# EAGLE design v1.1 Main (EAGLE 9.7.0)
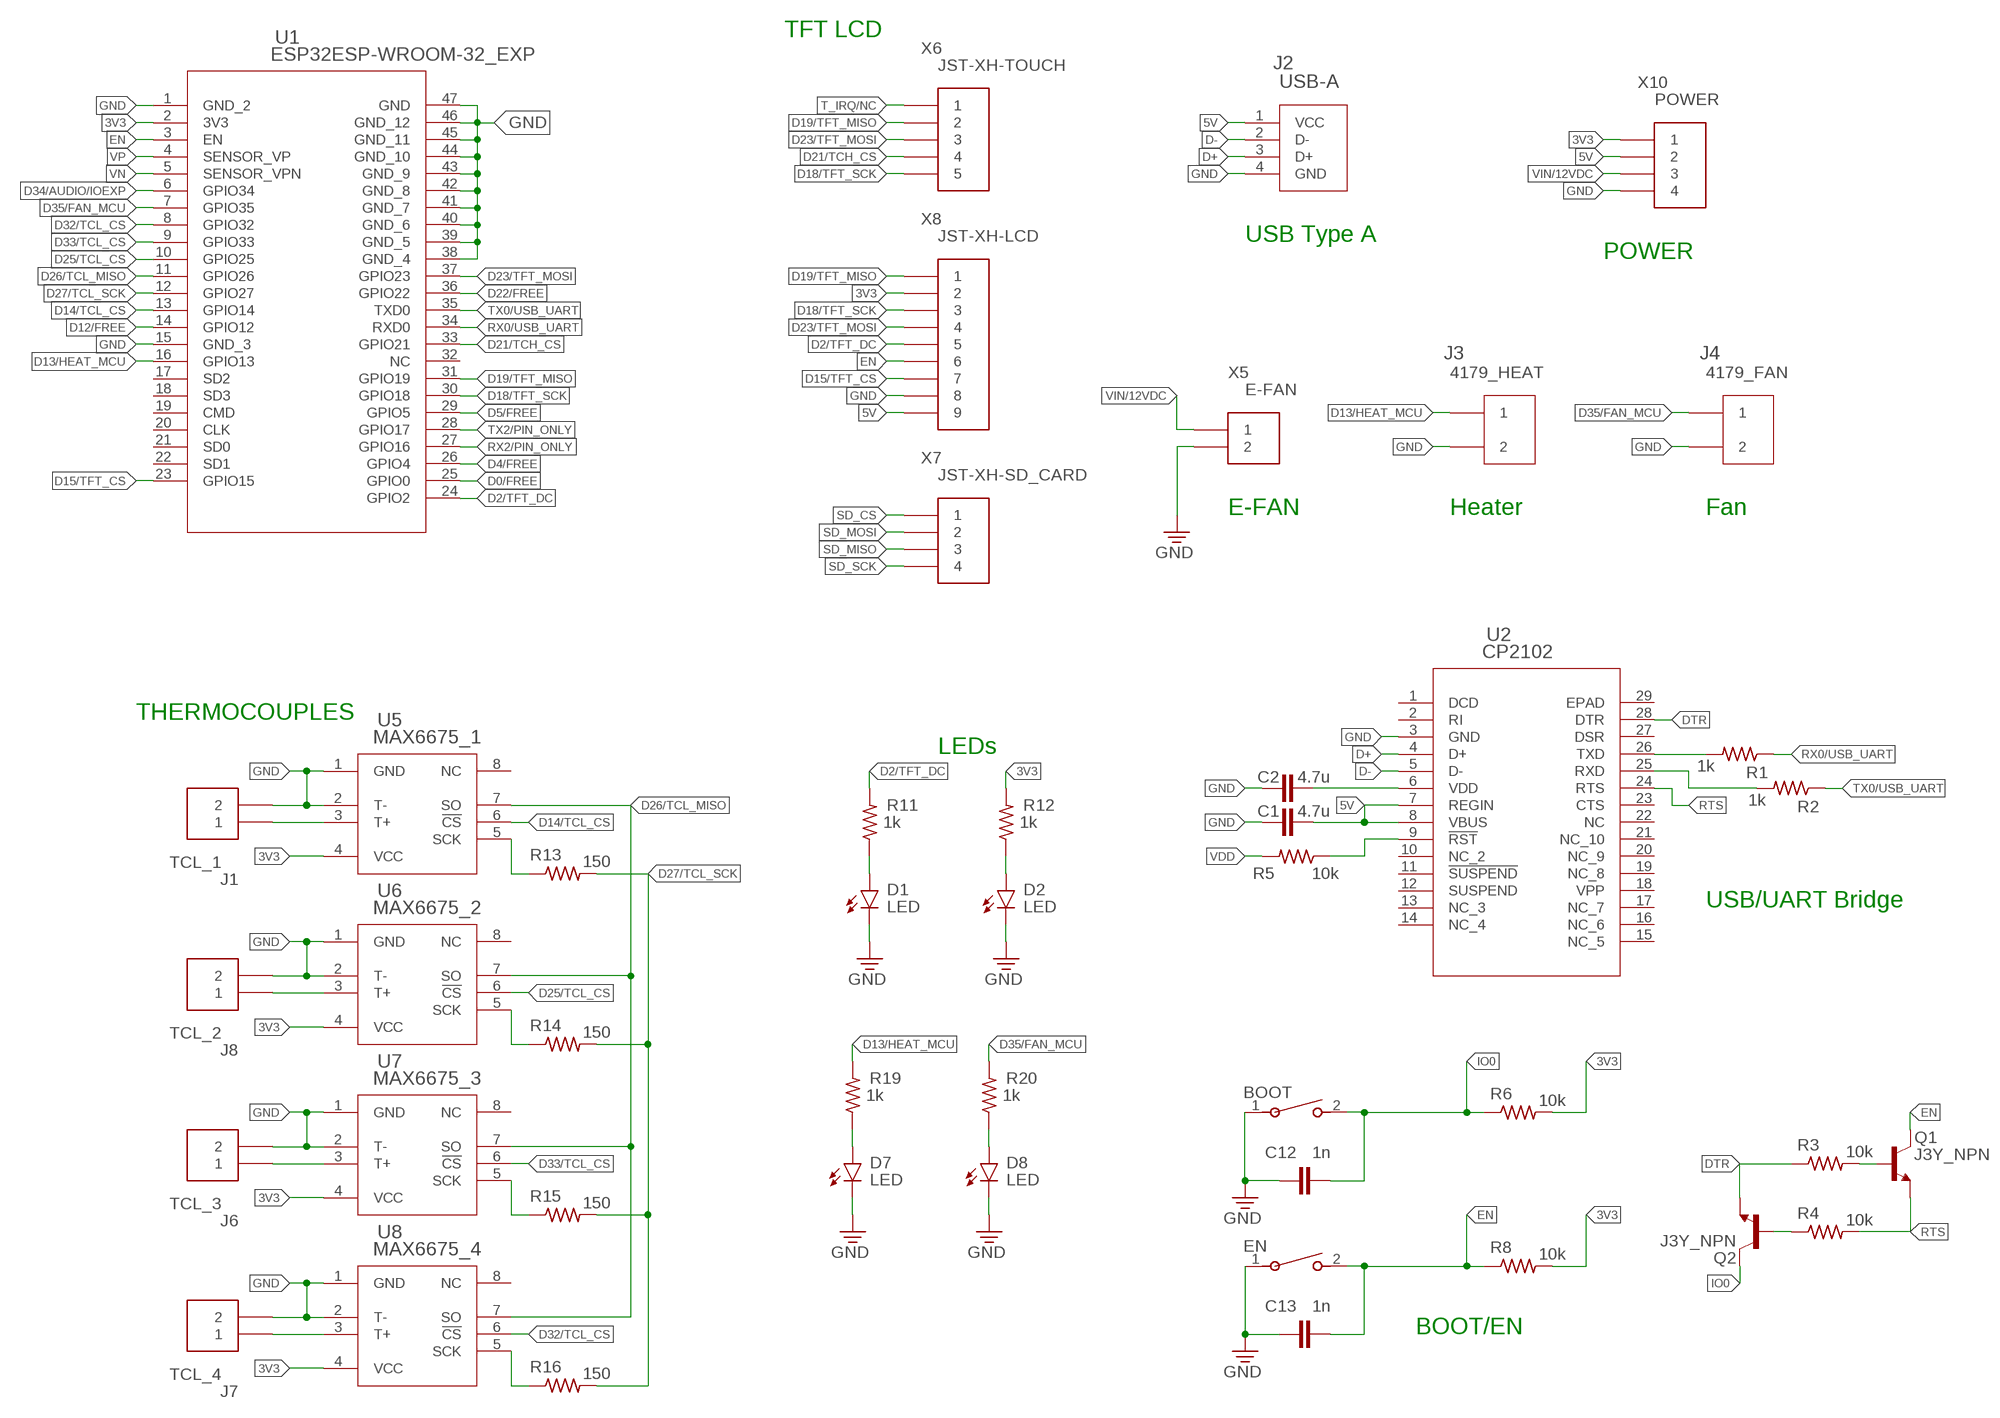
[diagram p0: schematic, sheet 1]

## Parts
BOOT  EVQ22705RSW_EVQ22705R_PAN  [SW_EVQ22705R_PAN]
C1  4.7u  C_CHIP-0805(2012-METRIC)  [CAPC2012X110]
C2  4.7u  C_CHIP-0805(2012-METRIC)  [CAPC2012X110]
C12  1n  C_CHIP-0805(2012-METRIC)  [CAPC2012X110]
C13  1n  C_CHIP-0805(2012-METRIC)  [CAPC2012X110]
D1  LED  CHIP-FLAT-B_0805  [LEDC2012X110N_FLAT-B]
D2  LED  CHIP-FLAT-B_0805  [LEDC2012X110N_FLAT-B]
D7  LED  CHIP-FLAT-B_0805  [LEDC2012X110N_FLAT-B]
D8  LED  CHIP-FLAT-B_0805  [LEDC2012X110N_FLAT-B]
EN  EVQ22705RSW_EVQ22705R_PAN  [SW_EVQ22705R_PAN]
J1  TCL_1  OSTVN02A150CONN_OSTVN02A150_OST  [CONN_OSTVN02A150_OST]
J2  USB-A  USB-A1VSB6_OST  [USB-A]
J3  4179_HEAT  4179_SDA  [41791]
J4  4179_FAN  4179_SDA  [41791]
J6  TCL_3  OSTVN02A150CONN_OSTVN02A150_OST  [CONN_OSTVN02A150_OST]
J7  TCL_4  OSTVN02A150CONN_OSTVN02A150_OST  [CONN_OSTVN02A150_OST]
J8  TCL_2  OSTVN02A150CONN_OSTVN02A150_OST  [CONN_OSTVN02A150_OST]
Q1  J3Y_NPN  NPN_SC59-BEC  [SC59]
Q2  J3Y_NPN  NPN_SC59-BEC  [SC59]
R1  1k  R-US_CHIP-0805(2012-METRIC)  [RESC2012X65]
R2  1k  R-US_CHIP-0805(2012-METRIC)  [RESC2012X65]
R3  10k  R-US_CHIP-0805(2012-METRIC)  [RESC2012X65]
R4  10k  R-US_CHIP-0805(2012-METRIC)  [RESC2012X65]
R5  10k  R-US_CHIP-0805(2012-METRIC)  [RESC2012X65]
R6  10k  R-US_CHIP-0805(2012-METRIC)  [RESC2012X65]
R8  10k  R-US_CHIP-0805(2012-METRIC)  [RESC2012X65]
R11  1k  R-US_CHIP-0805(2012-METRIC)  [RESC2012X65]
R12  1k  R-US_CHIP-0805(2012-METRIC)  [RESC2012X65]
R13  150  R-US_CHIP-0805(2012-METRIC)  [RESC2012X65]
R14  150  R-US_CHIP-0805(2012-METRIC)  [RESC2012X65]
R15  150  R-US_CHIP-0805(2012-METRIC)  [RESC2012X65]
R16  150  R-US_CHIP-0805(2012-METRIC)  [RESC2012X65]
R19  1k  R-US_CHIP-0805(2012-METRIC)  [RESC2012X65]
R20  1k  R-US_CHIP-0805(2012-METRIC)  [RESC2012X65]
U1  ESP32ESP-WROOM-32_EXP  [ESP32_SCH_PCB]
U2  CP2102  CP2102-GMQFN28_5X5_SIL  [QFN28_5X5_SIL]
U5  MAX6675_1  MAX6675_ISA_MXM  [_ISA_MXM]
U6  MAX6675_2  MAX6675_ISA_MXM  [_ISA_MXM]
U7  MAX6675_3  MAX6675_ISA_MXM  [_ISA_MXM]
U8  MAX6675_4  MAX6675_ISA_MXM  [_ISA_MXM]
X5  E-FAN  JST-XH-02-PIN-LONG-PAD  [-LONG-PAD]
X6  JST-XH-TOUCH  JST-XH-05-PIN-LONG-PAD  [JST-XH-05-PACKAGE-LONG-PAD]
X7  JST-XH-SD_CARD  JST-XH-04-PIN-LONG-PAD  [JST-XH-04-PACKAGE-LONG-PAD]
X8  JST-XH-LCD  JST-XH-09-PIN-LONG-PAD  [JST-XH-09-PACKAGE-LONG-PAD]
X10  POWER  JST-XH-04-PIN-LONG-PAD  [JST-XH-04-PACKAGE-LONG-PAD]

## Nets
3V3: R6.2 R8.2 R12.2 U1.2(3V3) U5.4(VCC) U6.4(VCC) U7.4(VCC) U8.4(VCC) X8.2 X10.1
5V: C1.2 J2.1(VCC) U2.7(REGIN) U2.8(VBUS) X8.9 X10.2
D0/FREE: U1.25(GPIO0)
D2/TFT_DC: R11.2 U1.24(GPIO2) X8.5
D4/FREE: U1.26(GPIO4)
D5/FREE: U1.29(GPIO5)
D12/FREE: U1.14(GPIO12)
D13/HEAT_MCU: J3.1 R19.2 U1.16(GPIO13)
D14/TCL_CS: U1.13(GPIO14) U5.6(!CS)
D15/TFT_CS: U1.23(GPIO15) X8.7
D18/TFT_SCK: U1.30(GPIO18) X6.5 X8.3
D19/TFT_MISO: U1.31(GPIO19) X6.2 X8.1
D21/TCH_CS: U1.33(GPIO21) X6.4
D22/FREE: U1.36(GPIO22)
D23/TFT_MOSI: U1.37(GPIO23) X6.3 X8.4
D25/TCL_CS: U1.10(GPIO25) U6.6(!CS)
D26/TCL_MISO: U1.11(GPIO26) U5.7(SO) U6.7(SO) U7.7(SO) U8.7(SO)
D27/TCL_SCK: R13.2 R14.2 R15.2 R16.2 U1.12(GPIO27)
D32/TCL_CS: U1.8(GPIO32) U8.6(!CS)
D33/TCL_CS: U1.9(GPIO33) U7.6(!CS)
D34/AUDIO/IOEXP: U1.6(GPIO34)
D35/FAN_MCU: J4.1 R20.2 U1.7(GPIO35)
D+: J2.3(D+) U2.4(D+)
D-: J2.2(D-) U2.5(D-)
DTR: Q2.E R3.1 U2.28(DTR)
EN: C13.2 EN.2 Q1.C R8.1 U1.3(EN) X8.6
GND: BOOT.1 C1.1 C2.1 C12.1 C13.1 D1.C D2.C D7.C D8.C EN.1 J1.2 J2.4(GND) J3.2 J4.2 J6.2 J7.2 J8.2 U1.1(GND_2) U1.15(GND_3) U1.38(GND_4) U1.39(GND_5) U1.40(GND_6) U1.41(GND_7) U1.42(GND_8) U1.43(GND_9) U1.44(GND_10) U1.45(GND_11) U1.46(GND_12) U1.47(GND) U2.3(GND) U5.1(GND) U5.2(T-) U6.1(GND) U6.2(T-) U7.1(GND) U7.2(T-) U8.1(GND) U8.2(T-) X5.2 X8.8 X10.4
IO0: BOOT.2 C12.2 Q2.C R6.1
N$1: D1.A R11.1
N$2: Q1.B R3.2
N$3: R1.2 U2.26(TXD)
N$4: Q2.B R4.1
N$5: R5.1 U2.9(!RST)
N$6: D2.A R12.1
N$26: D7.A R19.1
N$27: D8.A R20.1
RTS: Q1.E R4.2 U2.24(RTS)
RX0/USB_UART: R1.1 U1.34(RXD0)
RX2/PIN_ONLY: U1.27(GPIO16)
RXD: R2.2 U2.25(RXD)
SD_CS: X7.1
SD_MISO: X7.3
SD_MOSI: X7.2
SD_SCK: X7.4
T1: J1.1 U5.3(T+)
T2: J8.1 U6.3(T+)
T3: J6.1 U7.3(T+)
T4: J7.1 U8.3(T+)
T_IRQ/NC: X6.1
TCL_SCK1: R13.1 U5.5(SCK)
TCL_SCK2: R14.1 U6.5(SCK)
TCL_SCK3: R15.1 U7.5(SCK)
TCL_SCK4: R16.1 U8.5(SCK)
TX0/USB_UART: R2.1 U1.35(TXD0)
TX2/PIN_ONLY: U1.28(GPIO17)
VDD: C2.2 R5.2 U2.6(VDD)
VIN/12VDC: X5.1 X10.3
VN: U1.5(SENSOR_VPN)
VP: U1.4(SENSOR_VP)
Unconnected: U1.17(SD2) U1.18(SD3) U1.19(CMD) U1.20(CLK) U1.21(SD0) U1.22(SD1) U1.32(NC) U2.1(DCD) U2.2(RI) U2.10(NC_2) U2.11(!SUSPEND) U2.12(SUSPEND) U2.13(NC_3) U2.14(NC_4) U2.15(NC_5) U2.16(NC_6) U2.17(NC_7) U2.18(VPP) U2.19(NC_8) U2.20(NC_9) U2.21(NC_10) U2.22(NC) U2.23(CTS) U2.27(DSR) U2.29(EPAD) U5.8(NC) U6.8(NC) U7.8(NC) U8.8(NC)

## Notes on the sheet
- TFT LCD
- USB Type A
- POWER
- E-FAN | Heater | Fan
- THERMOCOUPLES
- LEDs
- USB/UART Bridge
- BOOT/EN

## Library data of the parts
BOOT EN = SD-SolderSync-Library:EVQ22705R; COPYRIGHT: Copyright (C) 2024 Ultra Librarian. All rights reserved.; MANUFACTURER_PART_NUMBER: EVQ-22705R; MFR_NAME: Panasonic
C1 C2 C12 C13 = Capacitor:C: Capacitor - Generic; CATEGORY: Capacitor
D1 D2 D7 D8 = LED:CHIP-FLAT-B; CATEGORY: LED; COLOR: BLUE; DESCRIPTION: CHIP LED FLAT; SUB-CATEGORY: CHIP; TYPE: FLAT_TOP; VALUE: LED_BLUE
J1 J6-J8 = Connectors:OSTVN02A150; COPYRIGHT: Copyright (C) 2025 Ultra Librarian. All rights reserved.; MANUFACTURER_PART_NUMBER: OSTVN02A150; MFR_NAME: On Shore Technology
J2 = SD-SolderSync-Library:USB-A; COPYRIGHT: Copyright (C) 2025 Ultra Librarian. All rights reserved.; MANUFACTURER_PART_NUMBER: USB-A1VSB6; MFR_NAME: On Shore Technology
J3 J4 = Connectors:4179; COPYRIGHT: Copyright (C) 2025 Ultra Librarian. All rights reserved.; MANUFACTURER_PART_NUMBER: 417910849; MFR_NAME: Molex Connector Corporation
Q1 Q2 = Transistor:NPN: NPN - Generic; CATEGORY: Transistor; SUB-CATEGORY: BJT; TYPE: NPN; VALUE: NPN
R1-R6 R8 R11-R16 R19 R20 = Resistor:R-US: Resistor Fixed - ANSI; CATEGORY: Resistor; SUB-CATEGORY: Fixed
U1 = SD-SolderSync-Library:ESP32; COPYRIGHT: Copyright (C) 2024 Ultra Librarian. All rights reserved.; MANUFACTURER_PART_NUMBER: ESP-WROOM-32; MFR_NAME: Espressif Systems
U2 = SD-SolderSync-Library:CP2102-GM; COPYRIGHT: Copyright (C) 2025 Ultra Librarian. All rights reserved.; MANUFACTURER_PART_NUMBER: CP2102-GM; MFR_NAME: Silicon Labs
U5-U8 = SD-SolderSync-Library:MAX6675; COPYRIGHT: Copyright (C) 2025 Ultra Librarian. All rights reserved.; MANUFACTURER_PART_NUMBER: MAX6675ISA+; MFR_NAME: Analog Devices Inc
X5 = Connectors:JST-XH-02-PIN: JST XH Connector 2 Pin Wire to board connector. Pitch: 2,54 mm, (0.100") Number of pins: 2 Created by Rembrandt Electronics www.rembrandtelectronics.com
X6 = Connectors:JST-XH-05-PIN: JST XH Connector 2 Pin Wire to board connector. Pitch: 2,54 mm, (0.100") Number of pins: 5 Created by Rembrandt Electronics www.rembrandtelectronics.com
X7 X10 = Connectors:JST-XH-04-PIN: JST XH Connector 2 Pin Wire to board connector. Pitch: 2,54 mm, (0.100") Number of pins: 4 Created by Rembrandt Electronics www.rembrandtelectronics.com
X8 = Connectors:JST-XH-09-PIN: JST XH Connector 2 Pin Wire to board connector. Pitch: 2,54 mm, (0.100") Number of pins: 9 Created by Rembrandt Electronics www.rembrandtelectronics.com

## Board
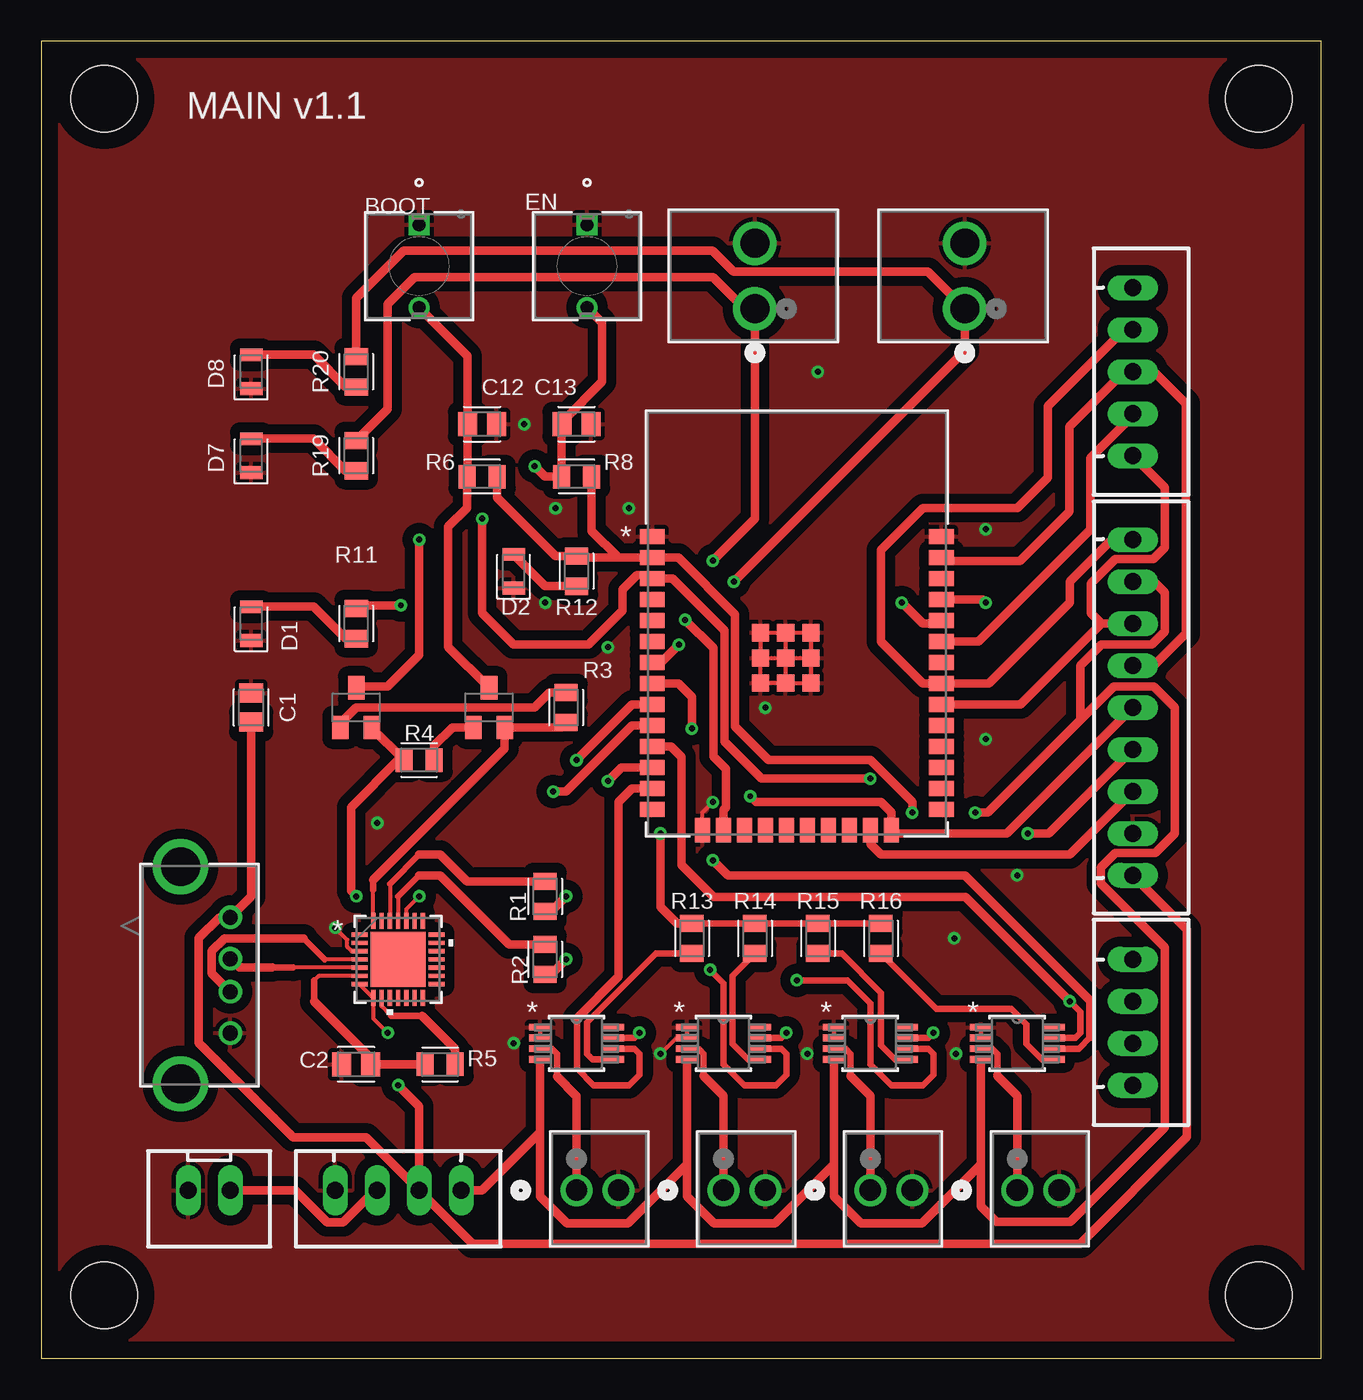
[diagram p1: board, top side]
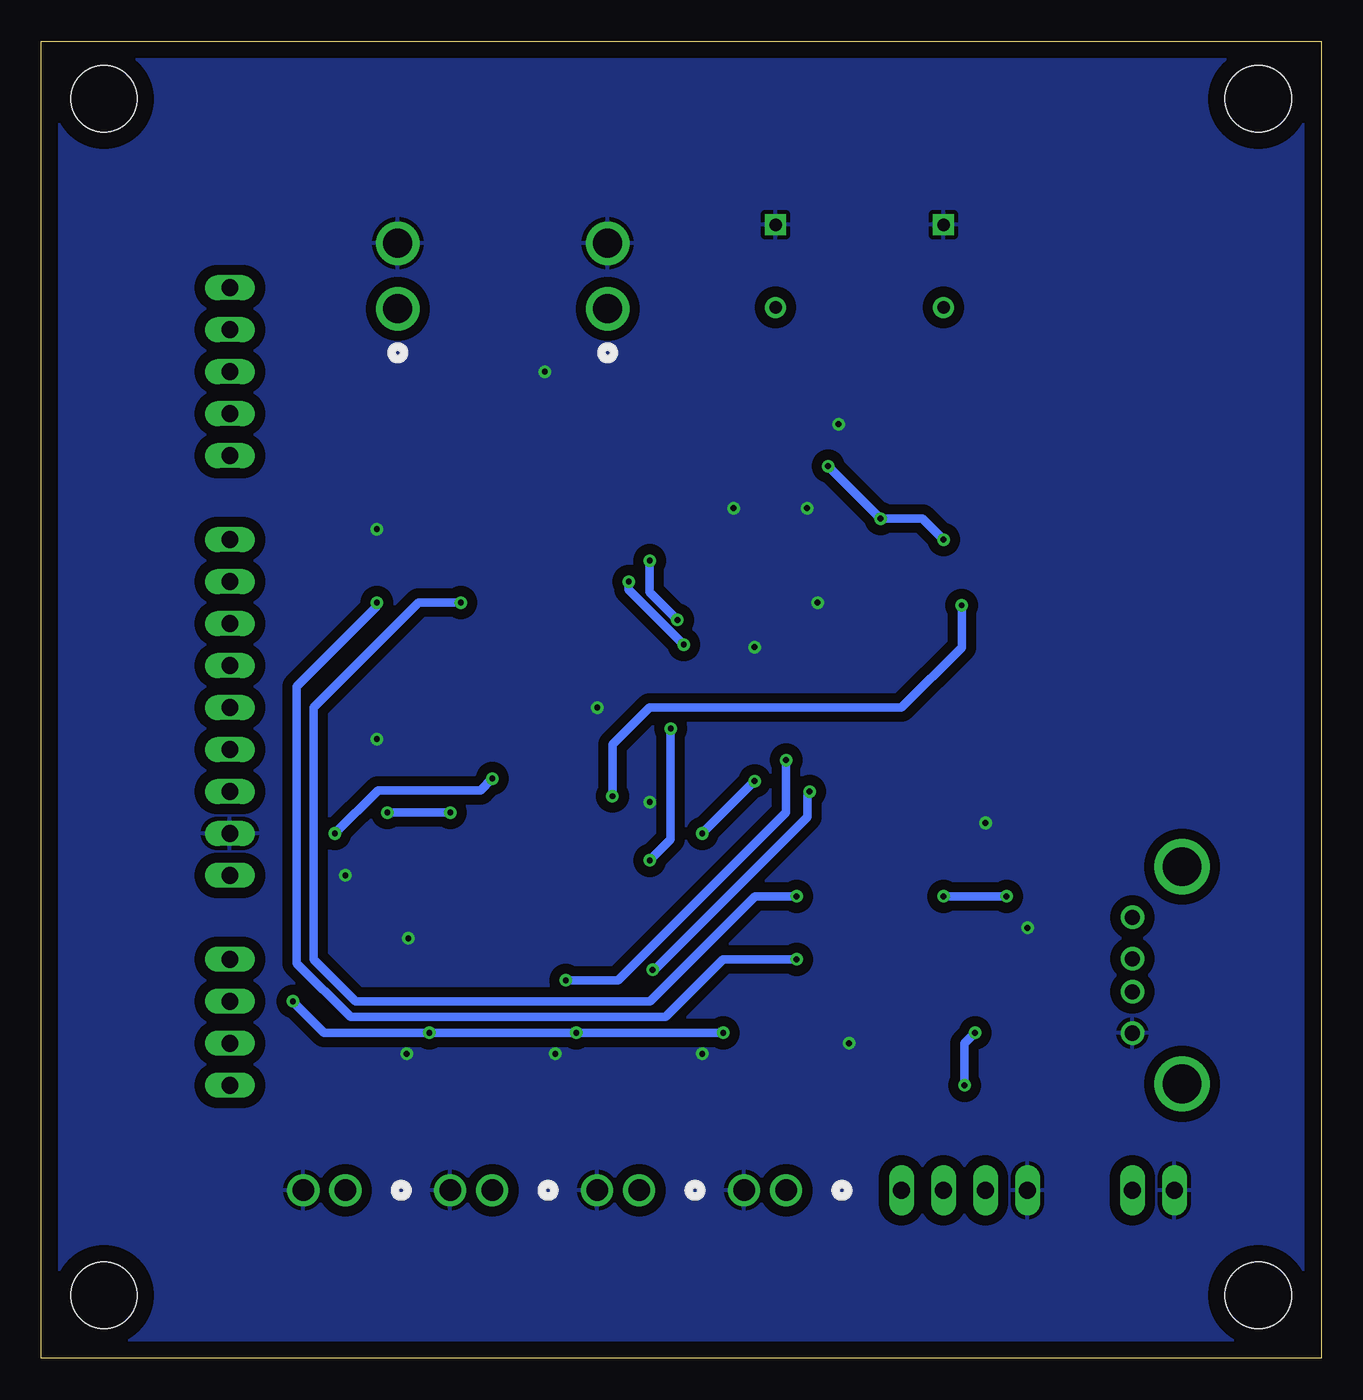
[diagram p2: board, bottom side, seen from below]

Size 77.45 x 79.68 mm. Coordinates in mm from the lower left corner, seen from the top.
Outline: 0,0 77.45,0 77.45,79.68 0,79.68 0,0
Copper layers (1*16): Top 0.035mm / dielectric 1.5mm / Bottom 0.035mm
Design rules "Fusion Electronics Design Rules": minimum track width 6mil, minimum drill 0.35mm, track to track 6mil, track to pad 6mil, pad to pad 6mil, via to via 6mil, smd to smd 6mil, copper to edge 40mil, drill to drill 6mil, minimum pad ring 10mil, minimum via ring 8mil, stop-mask expansion 4mil, vias tented up to drill 0mil, thermal gap 10mil
Holes 4 mm at 3.81,3.81 73.66,3.81 73.66,76.2 3.81,76.2

### Footprints (pad centres in the part's own frame; a part is rotated, then mirrored left to right if it is on the bottom)
SW_EVQ22705R_PAN = drill 0.762 pad 1.27 square: 1 0,0 | drill 0.762 pad 1.27: 2 5.004,0
CAPC2012X110 = smd 1.165 x 1.465: 1 -0.875,0; 2 0.875,0
LEDC2012X110N_FLAT-B = smd 0.762 x 1.362: A 1.025,0; C -1.025,0
CONN_OSTVN02A150_OST = drill 1.295 pad 1.803: 1 0,0; 2 2.54,0
USB-A = drill 0.914 pad 1.422: 1 0,0; 2 2.5,0; 3 4.5,0; 4 7,0 | drill 2.337 pad 2.845: 6 -3.07,-3; 7 10.07,-3
41791 = drill 1.753 pad 2.261: 1 0,0; 2 -3.96,0
SC59 = smd 1 x 1.4: B -0.95,-1.2; C 0,1.2; E 0.95,-1.2
RESC2012X65 = smd 1.031 x 1.42: 1 -0.919,0; 2 0.919,0
ESP32_SCH_PCB = smd 1.499 x 0.889: 1 -8.75,5.26; 2 -8.75,3.99; 3 -8.75,2.72; 4 -8.75,1.45; 5 -8.75,0.18; 6 -8.75,-1.09; 7 -8.75,-2.36; 8 -8.75,-3.63; 9 -8.75,-4.9; 10 -8.75,-6.17; 11 -8.75,-7.44; 12 -8.75,-8.71; 13 -8.75,-9.98; 14 -8.75,-11.25; 25 8.75,-11.25; 26 8.75,-9.98; 27 8.75,-8.71; 28 8.75,-7.44; 29 8.75,-6.17; 30 8.75,-4.9; 31 8.75,-3.63; 32 8.75,-2.36; 33 8.75,-1.09; 34 8.75,0.18; 35 8.75,1.45; 36 8.75,2.72; 37 8.75,3.99; 38 8.75,5.26 | smd 0.889 x 1.499: 15 -5.715,-12.501; 16 -4.445,-12.501; 17 -3.175,-12.501; 18 -1.905,-12.501; 19 -0.635,-12.501; 20 0.635,-12.501; 21 1.905,-12.501; 22 3.175,-12.501; 23 4.445,-12.501; 24 5.715,-12.501 | smd 1.041 x 1.041: 39 -0.681,-2.08; 40 -2.205,-0.556; 41 -2.205,-2.08; 42 -2.205,-3.604; 43 -0.681,-3.604; 44 0.843,-3.604; 45 0.843,-2.08; 46 0.843,-0.556; 47 -0.681,-0.556
QFN28_5X5_SIL = smd 0.965 x 0.254: 1 -2.324,1.5; 2 -2.324,1; 3 -2.324,0.5; 4 -2.324,0; 5 -2.324,-0.5; 6 -2.324,-1; 7 -2.324,-1.5; 15 2.324,-1.5; 16 2.324,-1; 17 2.324,-0.5; 18 2.324,0; 19 2.324,0.5; 20 2.324,1; 21 2.324,1.5 | smd 0.254 x 0.965: 8 -1.5,-2.324; 9 -1,-2.324; 10 -0.5,-2.324; 11 0,-2.324; 12 0.5,-2.324; 13 1,-2.324; 14 1.5,-2.324; 22 1.5,2.324; 23 1,2.324; 24 0.5,2.324; 25 0,2.324; 26 -0.5,2.324; 27 -1,2.324; 28 -1.5,2.324 | smd 3.353 x 3.353: 29 0,0
_ISA_MXM = smd 1.321 x 0.406: 1 -2.21,0.975; 2 -2.21,0.325; 3 -2.21,-0.325; 4 -2.21,-0.975; 5 2.21,-0.975; 6 2.21,-0.325; 7 2.21,0.325; 8 2.21,0.975
-LONG-PAD = drill 1.016 long: 1 -1.27,0; 2 1.27,0
JST-XH-05-PACKAGE-LONG-PAD = drill 1.016 long: 1 -5.08,0; 2 -2.54,0; 3 0,0; 4 2.54,0; 5 5.08,0
JST-XH-04-PACKAGE-LONG-PAD = drill 1.016 long: 1 -3.81,0; 2 -1.27,0; 3 1.27,0; 4 3.81,0
JST-XH-09-PACKAGE-LONG-PAD = drill 1.016 long: 1 -10.16,0; 2 -7.62,0; 3 -5.08,0; 4 -2.54,0; 5 0,0; 6 2.54,0; 7 5.08,0; 8 7.62,0; 9 10.16,0

### Placement (x,y rotation side)
BOOT  22.86,68.58 270 top
C1  12.7,39.37 270 top
C2  19.05,17.78 0 top
C12  26.67,56.52 180 top
C13  32.38,56.52 180 top
D1  12.7,44.45 90 top
D2  28.57,47.62 90 top
D7  12.7,54.61 90 top
D8  12.7,59.69 90 top
EN  33.02,68.58 270 top
J1  32.38,10.16 0 top
J2  11.43,26.67 270 top
J3  43.18,63.5 270 top
J4  55.88,63.5 270 top
J6  50.16,10.16 0 top
J7  59.05,10.16 0 top
J8  41.27,10.16 0 top
Q1  19.05,39.37 0 top
Q2  27.09,39.37 0 top
R1  30.48,27.94 90 top
R2  30.48,24.13 90 top
R3  31.75,39.37 90 top
R4  22.86,36.2 180 top
R5  24.13,17.78 180 top
R6  26.67,53.34 0 top
R8  32.38,53.34 0 top
R11  19.05,44.45 90 top
R12  32.38,47.62 90 top
R13  39.37,25.4 90 top
R14  43.18,25.4 90 top
R15  46.99,25.4 90 top
R16  50.8,25.4 90 top
R19  19.05,54.61 90 top
R20  19.05,59.69 90 top
U1  45.72,44.45 0 top
U2  21.59,24.13 0 top
U5  32.38,19.05 0 top
U6  41.27,19.05 0 top
U7  50.16,19.05 0 top
U8  59.05,19.05 0 top
X5  10.16,10.16 180 top
X6  66.04,59.69 270 top
X7  66.04,20.32 270 top
X8  66.04,39.37 270 top
X10  21.59,10.16 180 top

### Tracks (layer width: path | path; a pad name or v marks a point on that pad's centre or on a via)
3V3  (via drill 0.35)
  Top 0.254: 36.65,48.44 U1.2
  Top 0.508: 30.18,13.66 26.67,10.16 X10.1 | v52.7,33.02 52.7,33.66 50.16,36.2 44.01,36.2 41.99,38.22 41.99,45.01 38.55,48.44 U1.2 34.92,48.44 | X8.2 67.31,46.99 67.97,46.33 67.97,43.97 67.18,43.18 64.14,43.18 62.87,41.91 62.87,38.73 62.93,38.67 | 34.92,48.44 32.49,48.44 R12.2 31.11,48.54 27.59,52.07 R6.2 | R8.2 33.3,50.06 34.92,48.44 | 30.18,13.66 U5.4 | v56.52,33.02 57.28,33.02 62.93,38.67 | 62.93,38.67 64.9,40.64 67.31,40.64 68.58,39.37 68.58,31.75 67.41,30.58 65,30.58 64.11,29.69 64.11,28.73 67.97,24.86 67.97,13.97 62.26,8.26 57.78,8.26 56.84,9.2 56.84,11.72 | 30.18,13.66 30.18,9.79 31.81,8.15 35.5,8.15 39.06,11.72 | 39.06,11.72 U6.4 | 39.06,11.72 39.06,9.79 40.7,8.15 44.39,8.15 47.95,11.72 | 47.95,11.72 U7.4 | 47.95,11.72 47.95,9.79 49.59,8.15 53.28,8.15 56.84,11.72 | 56.84,11.72 U8.4
  Bottom 0.508: v52.7,33.02 v56.52,33.02
5V  (via drill 0.35)
  Top 0.254: 22.55,10.16 X10.2 | U2.7 U2.8 20.09,20.55 v20.95,19.68
  Top 0.508: X10.2 19.66,13.36 15.25,13.36 9.53,19.09 9.53,25.41 10.78,26.67 J2.1 12.7,27.94 C1.2 | X10.2 22.86,15.24 v21.59,16.51 | X10.2 26.09,6.93 62.87,6.93 69.32,13.39 69.32,25.93 X8.9
  Bottom 0.508: v20.95,19.68 21.59,19.05 v21.59,16.51
D2/TFT_DC  (via drill 0.35)
  Top 0.254: 51.44,32.38 U1.24
  Top 0.508: U1.24 51.63,31.75 58.42,31.75 X8.5 | v42.89,34 43.24,33.66 50.8,33.66 51.44,33.02 51.44,32.38 | R11.2 19.23,45.55 v21.76,45.55
  Bottom 0.508: v21.76,45.55 21.76,43.01 25.4,39.37 40.64,39.37 42.89,37.12 v42.89,34
D13/HEAT_MCU  (via drill 0.35)
  Top 0.508: v40.64,48.26 43.18,50.8 J3.1 42.55,63.5 40.64,65.41 22.58,65.41 20.95,63.78 20.95,57.43 R19.2 | v38.96,44.67 40.66,42.96 40.66,36.4 41.42,35.64 41.42,33.33 41.27,33.18 U1.16
  Bottom 0.508: v40.64,48.26 40.64,46.35 v38.96,44.67
D14/TCL_CS
  Top 0.406: U5.6 35.88,18.73 36.2,18.41 36.2,17.14 35.56,16.51 34.92,16.51 33.43,16.51 32.41,17.53 32.41,20.57
  Top 0.508: U1.13 35.74,34.47 34.92,33.66 34.92,23.09 32.41,20.57
D15/TFT_CS
  Top 0.508: U1.23 50.16,31.11 50.8,30.48 62.23,30.48 X8.7
D18/TFT_SCK
  Top 0.254: 66.04,44.76 X8.3
  Top 0.508: U1.30 59.23,39.55 64.14,44.45 | X8.3 64.14,44.45 | 64.14,44.45 63.5,45.09 63.5,46.86 65,48.36 67.29,48.36 67.97,49.05 67.97,52.68 X6.5
D19/TFT_MISO
  Top 0.508: X8.1 64.77,49.53 62.23,46.99 62.23,45.72 57.33,40.82 U1.31 53.34,40.82 50.8,43.36 50.8,48.9 53.34,51.44 59.05,51.44 60.91,53.29 60.91,57.61 65.41,62.1 66.04,62.1 X6.2
D21/TCH_CS
  Top 0.508: U1.33 56.7,43.36 63.48,50.14 63.48,54.46 66.04,57.02 X6.4
D23/TFT_MOSI
  Top 0.254: 69.24,44.53 69.24,45.09
  Top 0.508: X8.4 67.31,41.91 69.24,43.84 69.24,45.09 69.24,57.76 67.31,59.69 X6.3 65.53,59.69 62.2,56.36 62.2,51.23 59.2,48.22 54.69,48.22 U1.37
D25/TCL_CS  (via drill 0.35)
  Top 0.406: U6.6 44.77,18.73 45.09,18.41 45.09,17.14 44.45,16.51 42.55,16.51 41.27,17.78 41.27,22.68 v40.47,23.5
  Top 0.508: U1.10 35.74,38.28 31.75,34.29 v30.96,34.29
  Bottom 0.508: v30.96,34.29 31.09,34.17 31.09,32.75 40.34,23.5 v40.47,23.5
D26/TCL_MISO  (via drill 0.35)
  Top 0.406: U7.7 53.66,19.38 v53.98,19.68 | U6.7 44.77,19.38 v45.09,19.68 | U5.7 35.88,19.38 v36.2,19.68 | U8.7 62.55,19.38 62.87,19.68 62.87,20.95 v62.23,21.59
  Top 0.508: U1.11 38.1,37.01 38.73,36.38 38.73,29.84 40.66,27.91 55.91,27.91 v62.23,21.59
  Bottom 0.508: v36.2,19.68 v45.09,19.68 v53.98,19.68 60.33,19.68 v62.23,21.59
D27/TCL_SCK  (via drill 0.35)
  Top 0.406: R13.2 R14.2 R15.2 R16.2
  Top 0.508: U1.12 35.1,35.74 v34.29,34.92 | v37.47,31.75 37.47,27.3 38.45,26.32 R13.2
  Bottom 0.508: v34.29,34.92 v37.47,31.75
D32/TCL_CS  (via drill 0.35)
  Top 0.254: U8.6 61.59,18.73
  Top 0.406: 63.48,19.43 62.77,18.73 61.59,18.73
  Top 0.508: U1.8 38.55,40.82 39.37,40.01 v39.37,38.1 | v40.64,30.12 41.55,29.21 55.88,29.21 63.48,21.61 63.48,19.43
  Bottom 0.508: v40.64,30.12 39.37,31.39 v39.37,38.1
D33/TCL_CS  (via drill 0.35)
  Top 0.406: v45.72,22.86 48.78,22.86 50.16,21.47 50.16,17.78 51.44,16.51 53.34,16.51 53.98,17.14 53.98,18.41 53.66,18.73 U7.6
  Top 0.508: U1.9 35.74,39.55 v32.38,36.2
  Bottom 0.508: v32.38,36.2 32.38,33.02 42.55,22.86 v45.72,22.86
D35/FAN_MCU  (via drill 0.35)
  Top 0.508: v38.58,43.18 37.49,42.09 U1.7 | v41.91,46.99 55.88,60.96 J4.1 53.64,65.74 41.88,65.74 40.6,67.01 21.92,67.01 19.05,64.14 R20.2
  Bottom 0.508: v38.58,43.18 41.91,46.51 v41.91,46.99
D+
  Top 0.254: 11.4,22.2 J2.3 | U2.4 17.14,24.13
  Top 0.406: 17.14,24.13 15.88,25.4
  Top 0.508: 15.88,25.4 11.08,25.4 10.31,24.63 10.31,23.29 11.4,22.2
D-
  Top 0.254: U2.5 15.24,23.63
  Top 0.406: 15.24,23.63 13.97,23.63
  Top 0.508: 13.97,23.63 11.97,23.63 J2.2
DTR
  Top 0.254: U2.28 20.09,28.34
  Top 0.406: 20.09,28.34 20.09,28.95
  Top 0.508: R3.1 31.47,38.17 Q2.E 28.04,36.9 20.09,28.95
EN  (via drill 0.35)
  Top 0.254: R8.1 31.75,53.06 | 31.62,56.63 C13.2
  Top 0.508: v59.69,31.75 60.96,31.75 X8.6 | v50.16,35.08 43.56,35.08 41.33,37.31 41.33,44.04 38.2,47.17 U1.3 36.75,47.39 36.05,47.39 35.18,46.51 35.18,45.24 33.12,43.18 28.57,43.18 26.67,45.09 v26.67,50.8 | C13.2 31.46,56.47 R8.1 30.48,53.34 v29.84,53.98 | EN.2 33.94,62.66 33.94,59.08 31.62,56.77 31.62,56.63 | Q1.C 19.12,40.64 20.95,40.64 22.86,42.55 v22.86,49.53
  Bottom 0.508: v22.86,49.53 24.13,50.8 v26.67,50.8 v29.84,53.98 | v50.16,35.08 50.88,34.37 57.08,34.37 v59.69,31.75
GND  (via drill 0.35)
  Top 0.254: U1.40 U1.47 | U1.47 U1.46 U1.45 | U1.45 U1.44 U1.43 | U1.47 U1.39 | U1.40 U1.41 | U1.43 U1.42 | U1.42 U1.41 | U1.39 U1.43 | U1.41 U1.39 | U1.39 U1.45 | U5.1 U5.2 | U6.1 U6.2 38.42,19.38 v37.47,18.41 | U7.1 U7.2 | U8.1 U8.2 | U1.40 43.52,44.12 | v17.78,26.04 18.5,25.31 18.5,24.89 18.76,24.63 U2.3 | U1.42 43.81,40.55 | v40.64,33.66 40.01,33.02 U1.15
  other vias: 46.99,59.69 55.24,25.4 59.05,29.21 57.15,37.47 57.15,50.16 46.35,18.41 28.57,19.05 30.48,45.72 35.56,51.44 29.21,56.52 43.81,39.37 55.34,18.41 34.29,43.03 20.32,32.38 31.11,51.44
  pour Top (isolate 0.61): -1.19,-1.19 78.66,-1.19 78.66,81.2 -1.19,81.2
  pour Bottom (isolate 0.61): -2.46,-2.46 79.93,-2.46 79.93,82.47 -2.46,82.47
IO0
  Top 0.508: BOOT.2 25.8,60.64 C12.2 25.8,53.38 R6.1 25.75,51.44 24.62,50.31 24.62,43.04 Q2.C
N$1
  Top 0.508: D1.A 16.47,45.48 18.41,43.53 R11.1
N$2
  Top 0.508: Q1.B 18.1,38.42 19.05,39.37 29.84,39.37 30.77,40.29 R3.2
N$3
  Top 0.254: 21.09,28.71 U2.26
  Top 0.406: 22.86,30.48 21.09,28.71
  Top 0.508: R1.2 25.75,28.86 24.13,30.48 22.86,30.48
N$4
  Top 0.508: Q2.B 24.87,38.17 23.78,37.08 R4.1
N$5
  Top 0.254: U2.9 20.59,21.3 21.16,20.73
  Top 0.406: 23.03,20.73 21.16,20.73
  Top 0.508: R5.1 25.05,18.7 23.03,20.73
N$6
  Top 0.508: D2.A 28.57,48.61 30.48,46.71 R12.1
N$26
  Top 0.508: D7.A 16.47,55.63 18.41,53.69 R19.1
N$27
  Top 0.508: D8.A 16.47,60.72 18.41,58.77 R20.1
RTS  (via drill 0.35)
  Top 0.254: Q1.E 20.32,37.85 | v22.86,27.94 22.09,27.17 U2.24
  Top 0.508: Q1.E 20,38.14 R4.2 21.59,36.2 18.73,33.34 18.73,28.26 v19.05,27.94
  Bottom 0.508: v19.05,27.94 v22.86,27.94
RX0/USB_UART  (via drill 0.35)
  Top 0.508: U1.34 54.29,44.45 53.34,44.45 v52.07,45.72 | R1.1 30.83,27.02 v31.75,27.94
  Bottom 0.508: v52.07,45.72 54.61,45.72 60.96,39.37 60.96,24.13 58.42,21.59 40.62,21.59 34.27,27.94 v31.75,27.94
RXD
  Top 0.254: 21.59,27.94 U2.25
  Top 0.406: 22.86,29.21 21.59,27.94
  Top 0.508: R2.2 28.29,25.05 24.13,29.21 22.86,29.21
T1
  Top 0.406: 31.19,17.05 31.19,18.43 30.89,18.73 U5.3
  Top 0.508: 31.19,17.05 32.36,15.88 32.38,15.88 J1.1
T2
  Top 0.406: U6.3 39.11,18.68 39.82,18.68 40.08,18.43 40.08,17.07
  Top 0.508: 40.08,17.07 41.27,15.88 J8.1
T3
  Top 0.406: 48.97,17.07 48.97,18.43 48.67,18.73 U7.3
  Top 0.508: 48.97,17.07 50.16,15.88 J6.1
T4
  Top 0.406: 57.86,17.16 57.86,18.43 57.56,18.73 U8.3
  Top 0.508: 57.86,17.16 57.86,17.07 59.05,15.88 J7.1
TCL_SCK1
  Top 0.406: U5.5 33.36,18.07 33.02,18.41 33.02,20.32 37.18,24.48 R13.1
TCL_SCK2
  Top 0.406: R14.1 41.83,23.13 41.83,19.01 42.77,18.07 U6.5
TCL_SCK3
  Top 0.406: R15.1 48.44,24.48 50.8,22.12 50.8,18.93 51.66,18.07 U7.5
TCL_SCK4
  Top 0.406: R16.1 54.15,21.13 58.69,21.13 59.61,20.21 59.61,19.01 60.55,18.07 U8.5
TX0/USB_UART  (via drill 0.35)
  Top 0.508: U1.35 56.97,45.9 v57.15,45.72 | R2.1 30.83,23.21 v31.75,24.13
  Bottom 0.508: v31.75,24.13 36.2,24.13 39.69,20.64 58.74,20.64 62,23.9 62,40.64 57.15,45.49 v57.15,45.72
VDD
  Top 0.254: C2.2 19.93,18.18 | U2.6 16.78,23.13 16.51,22.86
  Top 0.406: 16.51,22.86 16.51,21.59
  Top 0.508: C2.2 R5.2 | 16.51,21.59 19.93,18.18
VIN/12VDC
  Top 0.508: X5.1 15.37,10.16 17.3,8.23 18.26,8.23 20.19,10.16 X10.3

### Text on the board
tPlace: MAIN v1.1